# Altium schematic sheet SPEAKER.SchDoc
size A; SheetNumber: 8; SheetTotal: 8
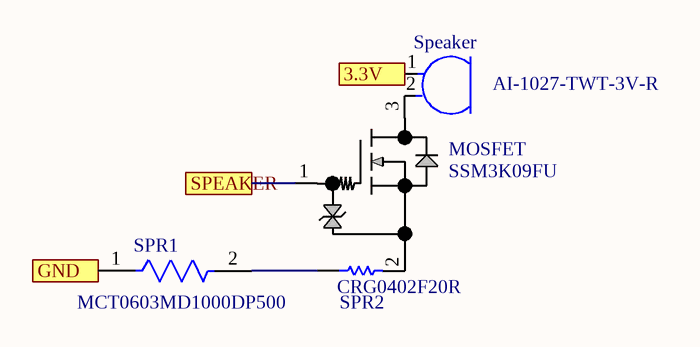
[diagram p0: SPEAKER.SchDoc]

## Parts
MOSFET  SSM3K09FU  [USM_TOS]
Speaker  AI-1027-TWT-3V-R  [FP-MA300D1-1-MFG]
SPR1  MCT0603MD1000DP500  [FP-MCT0603-MFG]
SPR2  CRG0402F20R  [RESC1005X40X25NL10T10]

## Ports
3.3V, GND, SPEAKER

## Nets
3.3V: Speaker.1 ; port 3.3V
GND: SPR1.1 ; port GND
SPEAKER: MOSFET.1 ; port SPEAKER
NetMOSFET_2: MOSFET.2 SPR2.2
NetMOSFET_3: MOSFET.3 Speaker.2
NetSPR1_2: SPR1.2 SPR2.1

## Library data of the parts
MOSFET = SSM3K09FU: No Description Available; Vendor: Toshiba; SourceLibrary: Toshiba_2018-12-14; Manufacturer_Part_Number: SSM3K09FU; Copyright: Copyright (C) 2018 Accelerated Designs. All rights reserved; RefDes: RefDes; Type: DEV
Speaker = CMP-06153-000004-1: Audio Indicators & Alerts 1300pF 300kHz Ultrasonic Sensor; Voltage Rating: 50V; Capacitance: 1.3nF; Frequency: 300kHz; Termination: Through Hole; Radiation Hardening: No; Package Quantity: 50; Number of Pins: 2; Max Operating Temperature: 70°C; Lead Free: Lead Free; Min Operating Temperature: -20°C; Mount: Flush
SPR1 = CMP-02407-007553-1: RES SMD 100 OHM 1% 1/8W 0603; Power Rating: 125mW; Max Power Dissipation: 150mW; Voltage Rating (DC): 75V; Temperature Coefficient: 25ppm/°C; Resistance: 100R; Tolerance: 0.5%; Features: Automotive AEC-Q200; Package Quantity: 1; Number of Terminations: 2; Weight: 7.1E-05oz; Case Code (Metric): 1608; REACH SVHC: No SVHC; Termination: SMD/SMT; Width: 0.8mm; Length: 0.061inch; Packaging: Tape and Reel; Case/Package: 0603; Height: 0.022inch; Min Operating Temperature: -55°C; Case Code (Imperial): 0603; Max Operating Temperature: 175°C; Voltage Rating: 75V; Composition: Thin Film
SPR2 = CMP-2002-05710-1: Manufacturer: TE Connectivity / AMP; Part Number: CRG0402F20R